# Altium schematic sheet Main.SchDoc
size A4
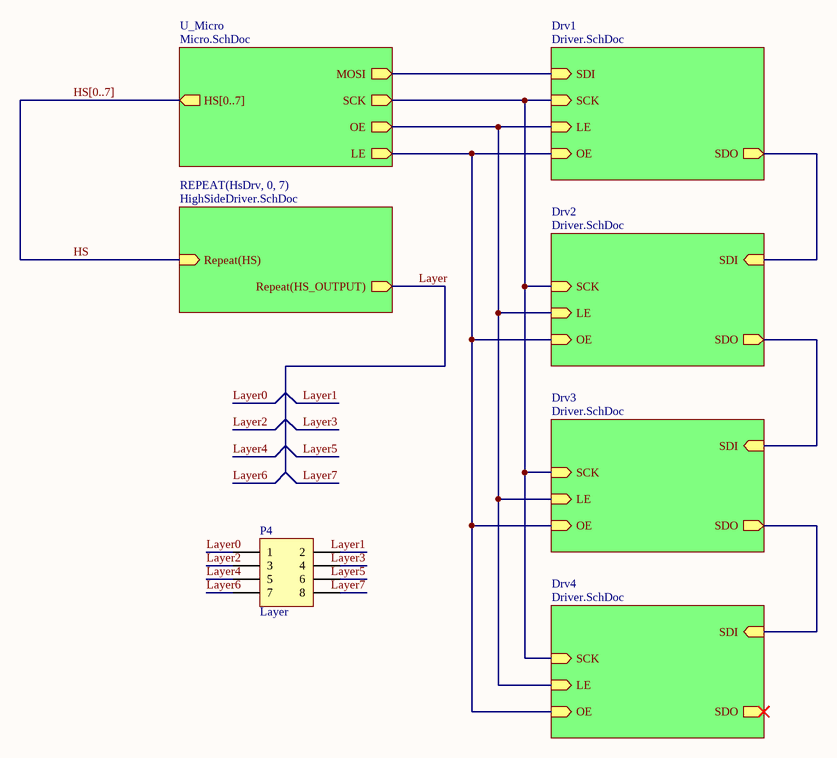
[diagram p0: Main.SchDoc]

## Parts
P4  Layer  [HDR2X4H]

## Sub-sheets
Drv1 = Driver.SchDoc: SCK (in), SDI (in), SDO (out), LE (in), OE (in)
Drv2 = Driver.SchDoc: SCK (in), SDI (in), SDO (out), LE (in), OE (in)
Drv3 = Driver.SchDoc: SCK (in), SDI (in), SDO (out), LE (in), OE (in)
Drv4 = Driver.SchDoc: SCK (in), SDI (in), SDO (out), LE (in), OE (in)
REPEAT(HsDrv, 0, 7) = HighSideDriver.SchDoc: Repeat(HS_OUTPUT) (out), Repeat(HS) (in)
U_Micro = Micro.SchDoc: SCK (out), MOSI (out), OE (out), LE (out), HS[0..7] (out)

## Nets
HS: sheet REPEAT(HsDrv, 0, 7)/Repeat(HS)
Layer: sheet REPEAT(HsDrv, 0, 7)/Repeat(HS_OUTPUT)
Layer0: P4.1
Layer1: P4.2
Layer2: P4.3
Layer3: P4.4
Layer4: P4.5
Layer5: P4.6
Layer6: P4.7
Layer7: P4.8
(unnamed): sheet U_Micro/SCK, sheet Drv3/SCK, sheet Drv2/SCK, sheet Drv1/SCK, sheet Drv4/SCK
(unnamed): sheet U_Micro/MOSI, sheet Drv1/SDI
(unnamed): sheet U_Micro/OE, sheet Drv3/LE, sheet Drv2/LE, sheet Drv1/LE, sheet Drv4/LE
(unnamed): sheet U_Micro/LE, sheet Drv3/OE, sheet Drv2/OE, sheet Drv1/OE, sheet Drv4/OE
(unnamed): sheet Drv3/SDI, sheet Drv2/SDO
(unnamed): sheet Drv3/SDO, sheet Drv4/SDI
(unnamed): sheet Drv2/SDI, sheet Drv1/SDO

## Buses and harness runs
bus HS[0..7] = sheet U_Micro/HS[0..7]

## Library data of the parts
P4 = Header 4X2H: Header, 4-Pin, Dual row, Right Angle; LatestRevisionDate: 17-Jul-2002; LatestRevisionNote: Re-released for DXP Platform.; Publisher: Altium Limited